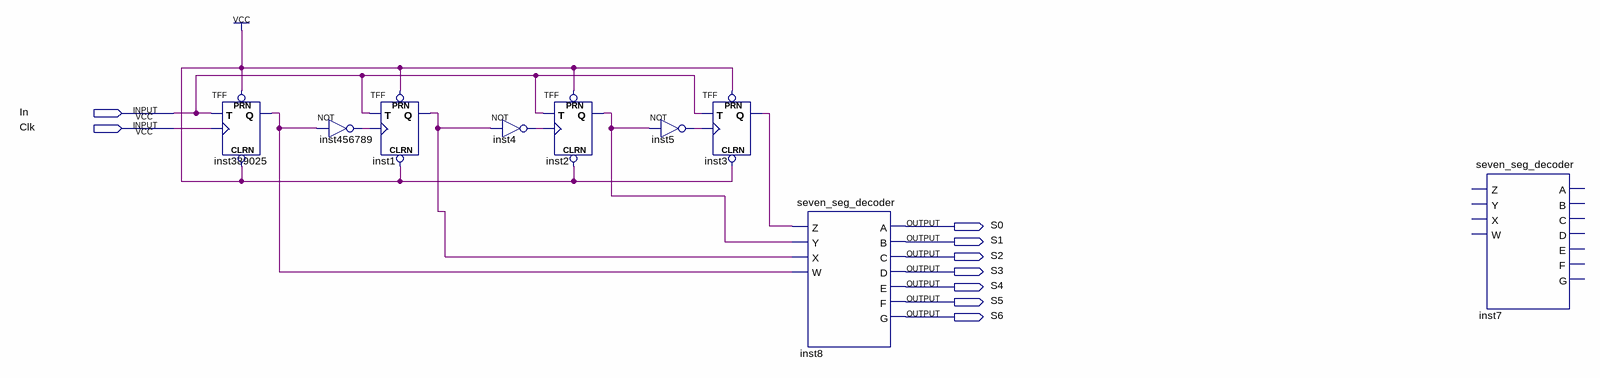
[diagram p0: schematic sheet]
// Quartus schematic lab10step3a.bdf as structural Verilog: 9 symbols, 9 pins
module lab10step3a (
  input  In,
  input  Clk,
  output S0,
  output S1,
  output S2,
  output S3,
  output S4,
  output S5,
  output S6
);

  wire inst1_q, inst2_q, inst3_q, inst4_out, inst5_out, inst389025_q, inst456789_out;

  TFF inst389025 (.PRN(1'b1), .CLRN(1'b1), .T(In), .CLK(Clk), .Q(inst389025_q));
  not inst456789 (inst456789_out, inst389025_q);
  TFF inst1 (.PRN(1'b1), .CLRN(1'b1), .T(In), .CLK(inst456789_out), .Q(inst1_q));
  not inst4 (inst4_out, inst1_q);
  TFF inst2 (.PRN(1'b1), .CLRN(1'b1), .T(In), .CLK(inst4_out), .Q(inst2_q));
  not inst5 (inst5_out, inst2_q);
  TFF inst3 (.PRN(1'b1), .CLRN(1'b1), .T(In), .CLK(inst5_out), .Q(inst3_q));
  seven_seg_decoder inst8 (
    .Z(inst3_q), .Y(inst2_q), .X(inst1_q), .W(inst389025_q), .A(S0), .B(S1), .C(S2), .D(S3), .E(S4), .F(S5),
    .G(S6));
  seven_seg_decoder inst7 ();  // open: Z, Y, X, W, A, B, C, D, E, F, G
endmodule
